# Altium schematic sheet схема платы пельтье.SchDoc
size A2
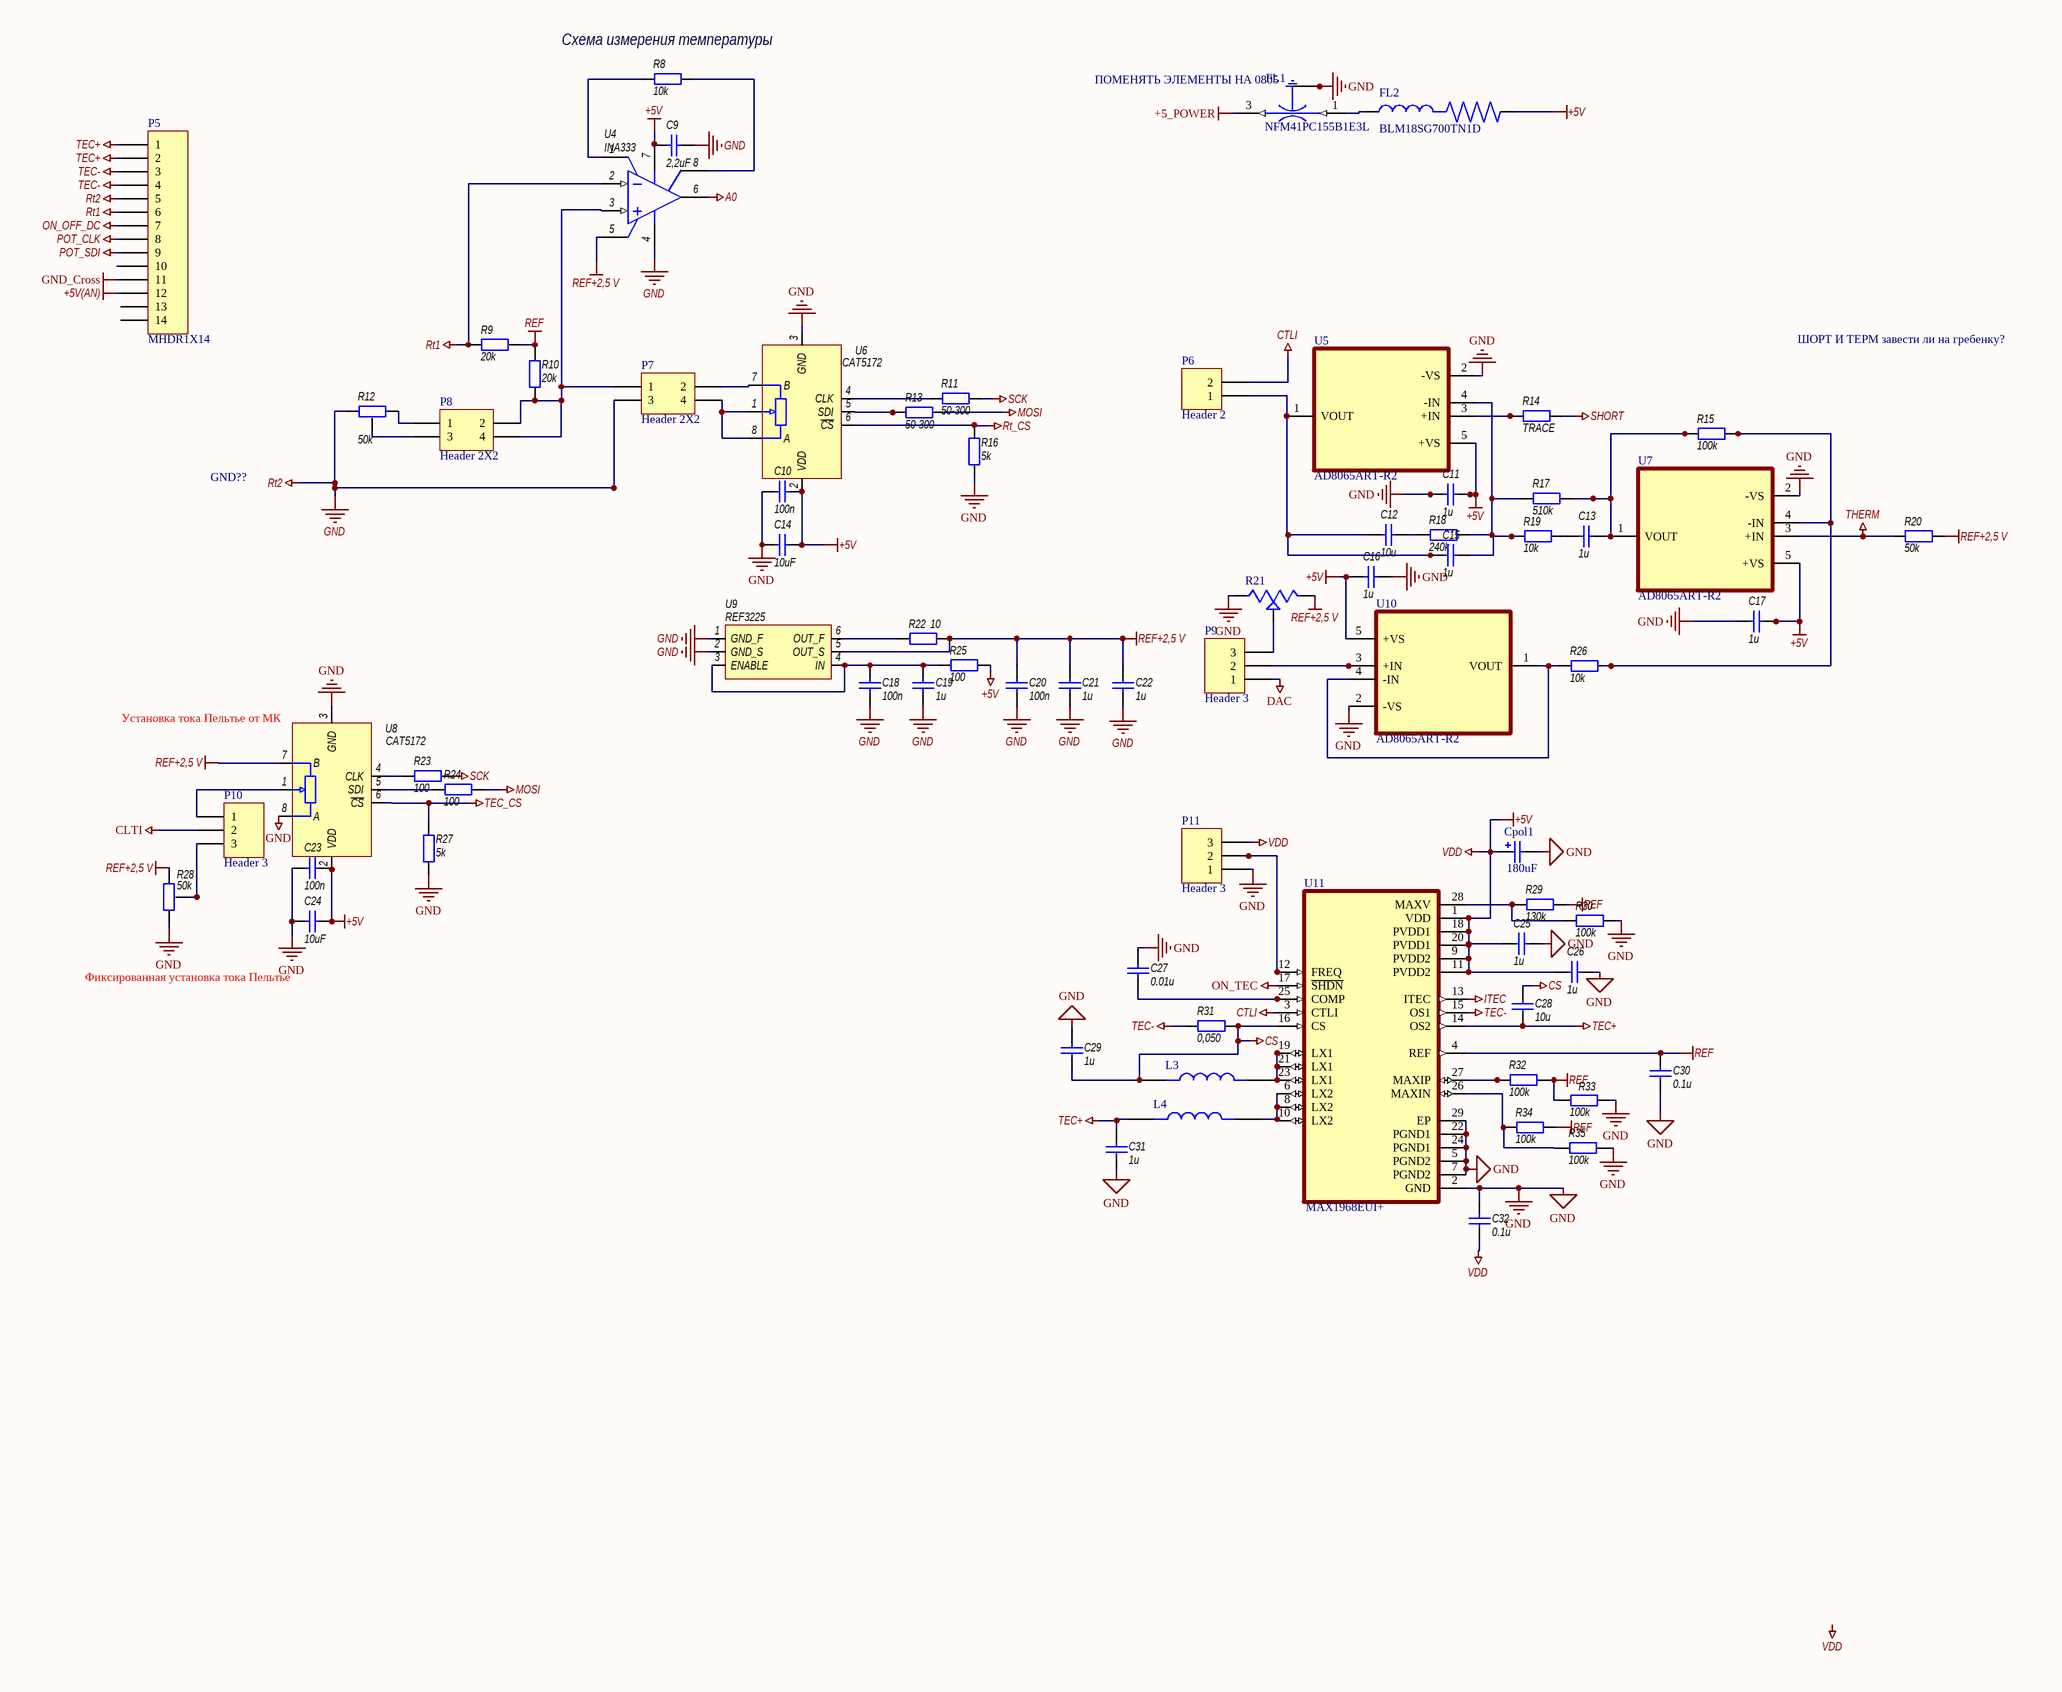
[diagram p0: схема платы пельтье.SchDoc]

## Parts
C9  2,2uF  [0603]
C10  100n  [0603]
C11  1u  [0603]
C12  10u  [0603]
C13  1u  [0603]
C14  10uF  [0603]
C15  1u  [0603]
C16  1u  [0603]
C17  1u  [0603]
C18  100n  [0603]
C19  1u  [0603]
C20  100n  [0603]
C21  1u  [0603]
C22  1u  [0603]
C23  100n  [0603]
C24  10uF  [0603]
C25  1u  [0603]
C26  1u  [0603]
C27  0.01u  [0603]
C28  10u  [0603]
C29  1u  [0603]
C30  0.1u  [0603]
C31  1u  [0603]
C32  0.1u  [0603]
Cpol1  180uF  [CAPPM7343X310N]
FL1  NFM41PC155B1E3L  [FIL_NFM41PC155B1E3L]
FL2  BLM18SG700TN1D  [BEADC2012X105N]
L3  (no value)  [IHLP]
L4  (no value)  [IHLP]
P5  MHDR1X14  [HDR1X14]
P6  Header 2  [HDR1X2]
P7  Header 2X2  [HDR2X2]
P8  Header 2X2  [HDR2X2]
P9  Header 3  [HDR1X3]
P10  Header 3  [HDR1X3]
P11  Header 3  [HDR1X3]
R8  10k  [0603]
R9  20k  [0603]
R10  20k  [0603]
R11  50-300  [0603]
R12  50k  [TRIM_3296X-1-203LF]
R13  50-300  [0603]
R14  TRACE  [0603]
R15  100k  [0603]
R16  5k  [0603]
R17  510k  [0603]
R18  240k  [0603]
R19  10k  [0603]
R20  50k  [0603]
R21  (no value)  [TRIM_3296X-1-203LF]
R22  10  [0603]
R23  100  [0603]
R24  100  [0603]
R25  100  [0603]
R26  10k  [0603]
R27  5k  [0603]
R28  50k  [TRIM_3296X-1-203LF]
R29  130k  [0603]
R30  100k  [0603]
R31  0,050  [RESC3216X65N]
R32  100k  [0603]
R33  100k  [0603]
R34  100k  [0603]
R35  100k  [0603]
U4  INA333  [SOP65P490X110-8N]
U5  AD8065ART-R2  [SOT95P290X145-5N]
U6  CAT5172  [SOT65P280X100-8N]
U7  AD8065ART-R2  [SOT95P290X145-5N]
U8  CAT5172  [SOT65P280X100-8N]
U9  REF3225  [SOT23-6]
U10  AD8065ART-R2  [SOT95P290X145-5N]
U11  MAX1968EUI+  [SOP65P637X110-29N]

## Nets
+5_POWER: FL1.3(OUT)
+5V: C9.2 C10.2 C11.2 C14.2 C16.1 C17.2 C23.2 C24.2 C25.1 C26.1 C32.2 Cpol1.1 FL2.2 P11.3 R25.2 U4.7(V+) U5.5(+VS) U6.2(VDD) U7.5(+VS) U8.2(VDD) U10.5(+VS) U11.1(VDD) U11.9(PVDD2) U11.11(PVDD2) U11.18(PVDD1) U11.20(PVDD1)  [also labelled VDD]
+5V(AN): P5.12
A0: U4.6(OUT)
CLTI: P10.2
CS: C28.1 C29.2 L3.1 R31.2 U11.16(CS)
CTLI: P6.2 U11.3(CTLI)
DAC: P9.1
GND: C9.1 C10.1 C11.1 C14.1 C16.2 C17.1 C18.2 C19.2 C20.2 C21.2 C22.2 C23.1 C24.1 C25.2 C26.2 C27.1 C29.1 C30.2 C31.2 C32.1 Cpol1.2 FL1.2(GND) FL1.2_1(GND) FL1.2_3(GND) FL1.2_4(GND) P5.5 P7.3 P11.1 R12.3 R16.1 R21.1(CCW) R27.1 R28.3 R30.2 R33.2 R35.2 U4.4(V-) U5.2(-VS) U6.3(GND) U7.2(-VS) U8.3(GND) U8.8(A) U9.1(GND_F) U9.2(GND_S) U10.2(-VS) U11.2(GND) U11.5(PGND2) U11.7(PGND2) U11.22(PGND1) U11.24(PGND1) U11.29(EP)  [also labelled Rt2]
GND_Cross: P5.11
ITEC: U11.13(ITEC)
MOSI: R13.2 R24.2
ON_OFF_DC: P5.7
ON_TEC: U11.17(~{SHDN})
POT_CLK: P5.8
POT_SDI: P5.9
REF: C30.1 R9.2 R10.2 R29.2 R32.2 R33.1 R34.2 U11.4(REF)
REF+2,5 V: C20.1 C21.1 C22.1 R20.2 R21.3(CW) R22.2 R28.1 U4.5(REF) U8.7(B) U9.5(OUT_S)
Rt1: P5.6 R9.1 U4.2(IN-)
Rt_CS: R16.2 U6.6(~{CS})
SCK: R11.2 R23.2
SHORT: R14.2
TEC+: C28.2 C31.1 L4.1 P5.1 P5.2 U11.14(OS2)
TEC-: P5.3 P5.4 R31.1 U11.15(OS1)
TEC_CS: R27.2 U8.6(~{CS})
THERM: R20.1 U7.3(+IN)
NetC12_1: C12.1 C15.1 P6.1 U5.1(VOUT)
NetC12_2: C12.2 R18.1
NetC13_1: C13.1 R19.2
NetC13_2: C13.2 R15.1 R17.2 U7.1(VOUT)
NetC15_2: C15.2 R17.1 R18.2 R19.1 U5.4(-IN)
NetC18_1: C18.1 C19.1 R25.1 U9.3(ENABLE) U9.4(IN)
NetC27_2: C27.2 U11.25(COMP)
NetFL1_1: FL1.1(IN) FL2.1
NetL3_2: L3.2 U11.19(LX1) U11.21(LX1) U11.23(LX1)
NetL4_2: L4.2 U11.6(LX2) U11.8(LX2) U11.10(LX2)
NetP7_1: P7.1 P8.2 P8.4 R10.1 U4.3(IN+)
NetP7_2: P7.2 U6.7(B)
NetP7_4: P7.4 U6.1 U6.8(A)
NetP8_1: P8.1 R12.1
NetP8_3: P8.3 R12.2
NetP9_2: P9.2 U10.3(+IN)
NetP9_3: P9.3 R21.2(WIPER)
NetP10_1: P10.1 U8.1
NetP10_3: P10.3 R28.2
NetP11_2: P11.2 U11.12(FREQ)
NetR8_1: R8.1 U4.1(RG)
NetR8_2: R8.2 U4.8(RG)
NetR11_1: R11.1 U6.4(CLK)
NetR13_1: R13.1 U6.5(SDI)
NetR14_1: R14.1 U5.3(+IN)
NetR15_2: R15.2 R26.2 U7.4(-IN)
NetR22_1: R22.1 U9.6(OUT_F)
NetR23_1: R23.1 U8.4(CLK)
NetR24_1: R24.1 U8.5(SDI)
NetR26_1: R26.1 U10.1(VOUT) U10.4(-IN)
NetR29_1: R29.1 R30.1 U11.28(MAXV)
NetR32_1: R32.1 U11.27(MAXIP)
NetR34_1: R34.1 R35.1 U11.26(MAXIN)

Not connected (* = marked no-connect by the designer): P5 10 13 14

## Notes on the sheet
- (near R8) Схема измерения температуры
- (near FL1) ПОМЕНЯТЬ ЭЛЕМЕНТЫ НА 0805
- ШОРТ И ТЕРМ завести ли на гребенку?
- GND??
- (near U8) Установка тока Пельтье от МК
- Фиксированная установка тока Пельтье
- Labels drawn without touching a wire or pin: VDD

## Library data of the parts
C9 C14 C24 = _capacitor: Model: 0603 100n; Value: 100n
C10 C18 C20 C23 = _capacitor: Model: 0603 100n; Value: 100n
C11 C13 C15-C17 C19 C21 C22 C25 C26 C29 C31 = _capacitor: Model: 0603 1u; Value: 1u
C12 C27 C28 C30 C32 = _capacitor: Model: 0603 1u; Value: 1u
Cpol1 = Cap Pol2: Polarized Capacitor (Axial); Published: 8-Jun-2000; LatestRevisionDate: 17-Jul-2002; LatestRevisionNote: Re-released for DXP Platform.; PackageReference: POLAR0.8; Publisher: Altium Limited; PackageDescription: Polarized Capacitor; 2 Leads
FL1 = NFM41PC155B1E3L: ÐšÐ¾Ð½Ð´ÐµÐ½ÑÐ°Ñ‚Ð¾Ñ€ SMD Ñ ÐµÐ¼ÐºÐ¾ÑÑ‚ÑŒÑŽ: 1.5 ÐœÐšÐ¤ Ð¢Ð¾Ð». 20%. ÐÐ¾Ð¼Ð¸Ð½Ð°Ð»ÑŒÐ½Ð¾Ðµ Ð½Ð°Ð¿Ñ€ÑÐ¶ÐµÐ½Ð¸Ðµ: 25Vdc; MF: Murata; Price: None; Value: *; SnapEDA_Link: https://www.snapeda.com/parts/NFM41PC155B1E3L/Murata/view-part/4383493/?ref=snap; Package: NONSTANDARD; Availability: Unavailable; DigiKey-Purchase-URL: https://snapeda.com/shop?store=DigiKey&id=4383493; MP: NFM41PC155B1E3L
FL2 = BLM21SP111SN1D: 110 Ð¾Ð¼ @ 100 ÐœÐ“Ñ† 1 Ð»Ð¸Ð½Ð¸Ñ ÑÐ»ÐµÐºÑ‚Ñ€Ð¾Ð¿ÐµÑ€ÐµÐ´Ð°Ñ‡ Ñ„ÐµÑ€Ñ€Ð¸Ñ‚Ð¾Ð²Ñ‹Ð¹ ÑˆÐ°Ñ€Ð¸Ðº 0805 (2012 ÐœÐµÑ‚Ñ€Ð¸ÐºÐ°) 5A; MF: Murata; Price: None; Value: *; SnapEDA_Link: https://www.snapeda.com/parts/BLM21SP111SN1D/Murata/view-part/4302973/?ref=snap; Package: 2012 Murata; Availability: Unavailable; MP: BLM21SP111SN1D
L3 L4 = LQH5BPN3R3NT0L: Ð˜Ð½Ð´ÑƒÐºÑ‚Ð¾Ñ€ Ñ Ð¸Ð½Ð´ÑƒÐºÑ‚Ð¸Ð²Ð½Ð¾ÑÑ‚ÑŒÑŽ: 3,3 uH Tol. + / -30%, Ð¿Ð°ÐºÐµÑ‚: 2020 (5050); MF: Murata; Package: - Murata; Price: None; Value: *; MP: LQH5BPN3R3NT0L; SnapEDA_Link: https://www.snapeda.com/parts/LQH5BPN3R3NT0L/Murata/view-part/4550758/?ref=snap; Availability: Unavailable
P5 = MHDR1X14: Header, 14-Pin; LatestRevisionDate: 17-Jul-2002; LatestRevisionNote: Re-released for DXP Platform.; Publisher: Altium Limited
P6 = Header 2: Header, 2-Pin; LatestRevisionDate: 17-Jul-2002; LatestRevisionNote: Re-released for DXP Platform.; Publisher: Altium Limited
P7 P8 = Header 2X2: Header, 2-Pin, Dual row; LatestRevisionDate: 17-Jul-2002; LatestRevisionNote: Re-released for DXP Platform.; Publisher: Altium Limited
P9-P11 = Header 3: Header, 3-Pin; LatestRevisionDate: 17-Jul-2002; LatestRevisionNote: Re-released for DXP Platform.; Publisher: Altium Limited
R8 R19 R26 = _resistor: Model: 0603 10k; Value: 10k
R9 R10 R14-R18 R20 R27 R29 R30 R32-R35 = _resistor: Model: 0603 10k; Value: 10k
R11 R13 R31 = _resistor: Model: 0603 100; Value: 100
R12 R28 = _resistor_pot: 3224J; Model: 3266P-1-102LF; Value: 1k
R21 = 3296W-1-224LF: Trimmer Resistors - Through Hole; MF: Bourns; Availability: Unavailable; SnapEDA_Link: https://www.snapeda.com/parts/3296W-1-224LF/Bourns/view-part/2705744/?ref=snap; MP: 3296W-1-224LF; Value: *; Price: None; Package: None
R22 = _resistor: Model: 0603 10; Value: 10
R23-R25 = _resistor: Model: 0603 100; Value: 100
U5 U7 U10 = AD8065ART-R2: Ð£ÑÐ¸Ð»Ð¸Ñ‚ÐµÐ»ÑŒ Ð¾Ð±Ñ€Ð°Ñ‚Ð½Ð¾Ð¹ ÑÐ²ÑÐ·Ð¸ Ð¿Ð¾ Ð½Ð°Ð¿Ñ€ÑÐ¶ÐµÐ½Ð¸ÑŽ 1 Ñ†ÐµÐ¿ÑŒ Ñ€ÐµÐ»ÑŒÑ-Ñ€ÐµÐ»ÑŒÑ SOT-23-5; MF: Analog Devices; MP: AD8065ART-R2; Package: SOT-23-5 Analog Devices; SnapEDA_Link: https://www.snapeda.com/parts/AD8065ART-R2/Analog%20Devices%20Inc./view-part/888431/?ref=snap; Price: None; Availability: Unavailable; Value: *; DigiKey-Purchase-URL: https://snapeda.com/shop?store=DigiKey&id=888431
U6 U8 = CAT5172: Digital potentiometr 256-position SPI; Model: CAT5172; ComponentLink1Description: Datasheet; ComponentLink1URL: X:\Projects\__MY_AD_LIB\Datasheets\CAT5172.pdf
U9 = REF32XX: SERIES VOLTAGE REFERENCE; Model: REF3225; ComponentLink1URL: X:\Projects\__MY_AD_LIB\Datasheets\ref3233.pdf; ComponentLink1Description: Datasheet
U11 = MAX1968EUI+: Thermoelectric Cooler PMIC 28-TSSOP-EP; MF: Maxim Integrated; MP: MAX1968EUI+; SnapEDA_Link: https://www.snapeda.com/parts/MAX1968EUI+/Maxim%20Integrated/view-part/43529/?ref=snap; Availability: Unavailable; Value: *; Package: TSSOP-28 Maxim; Price: None
U4 = INA333: Model: INA333; ComponentLink1Description: Datasheet; ComponentLink1URL: X:\Projects\__MY_AD_LIB\Datasheets\INA333.pdf